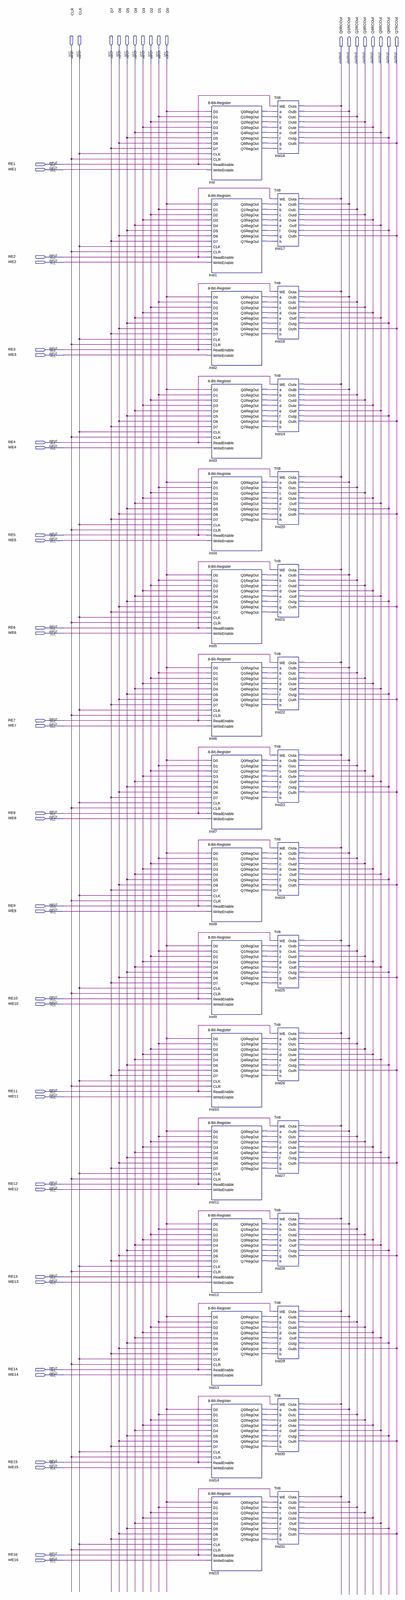
[diagram p0: schematic sheet, whole]
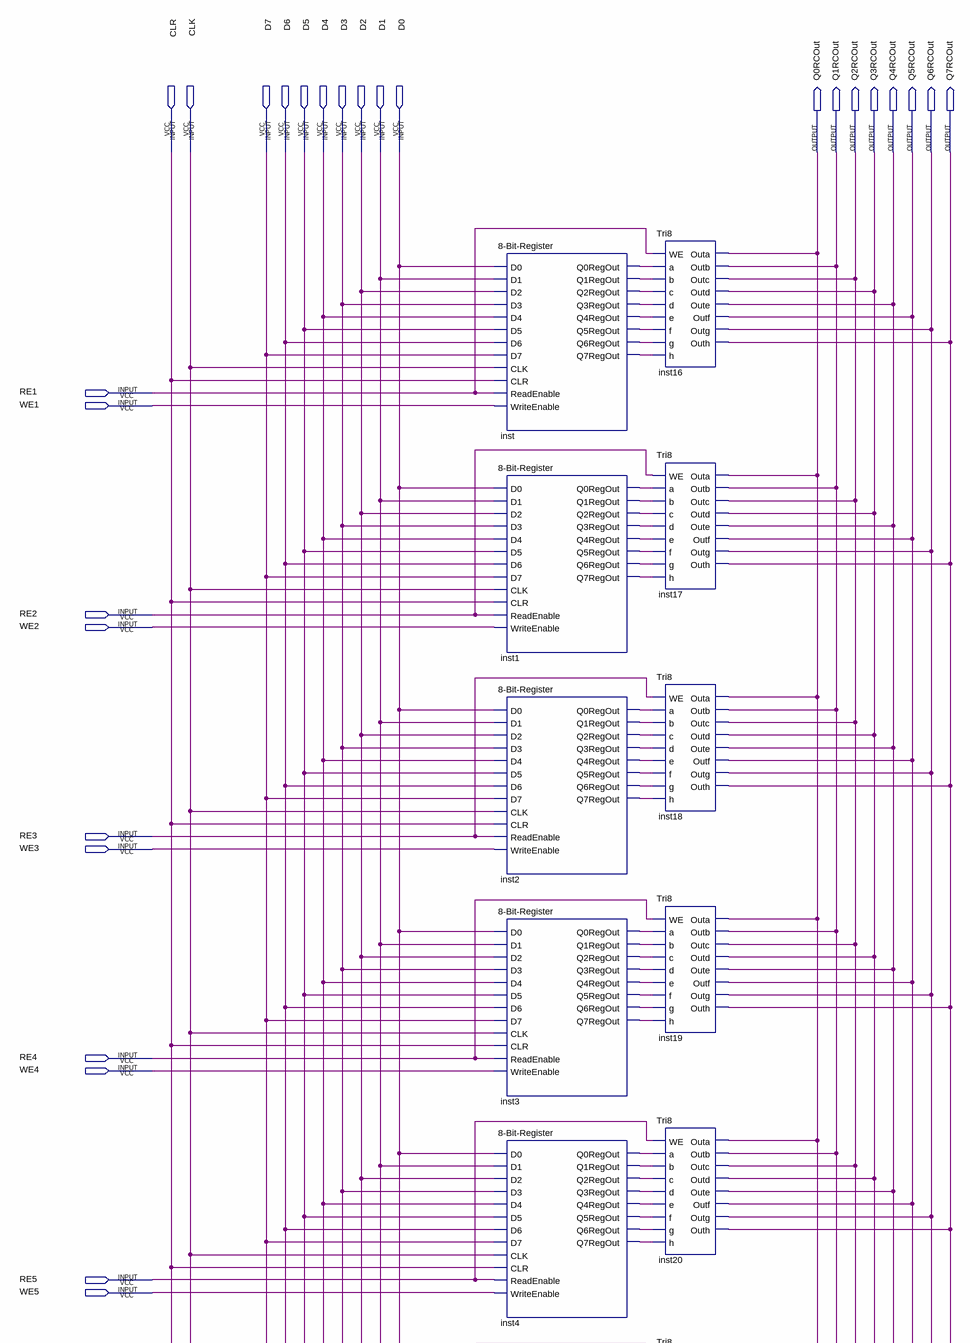
[diagram p1: schematic sheet, upper part]
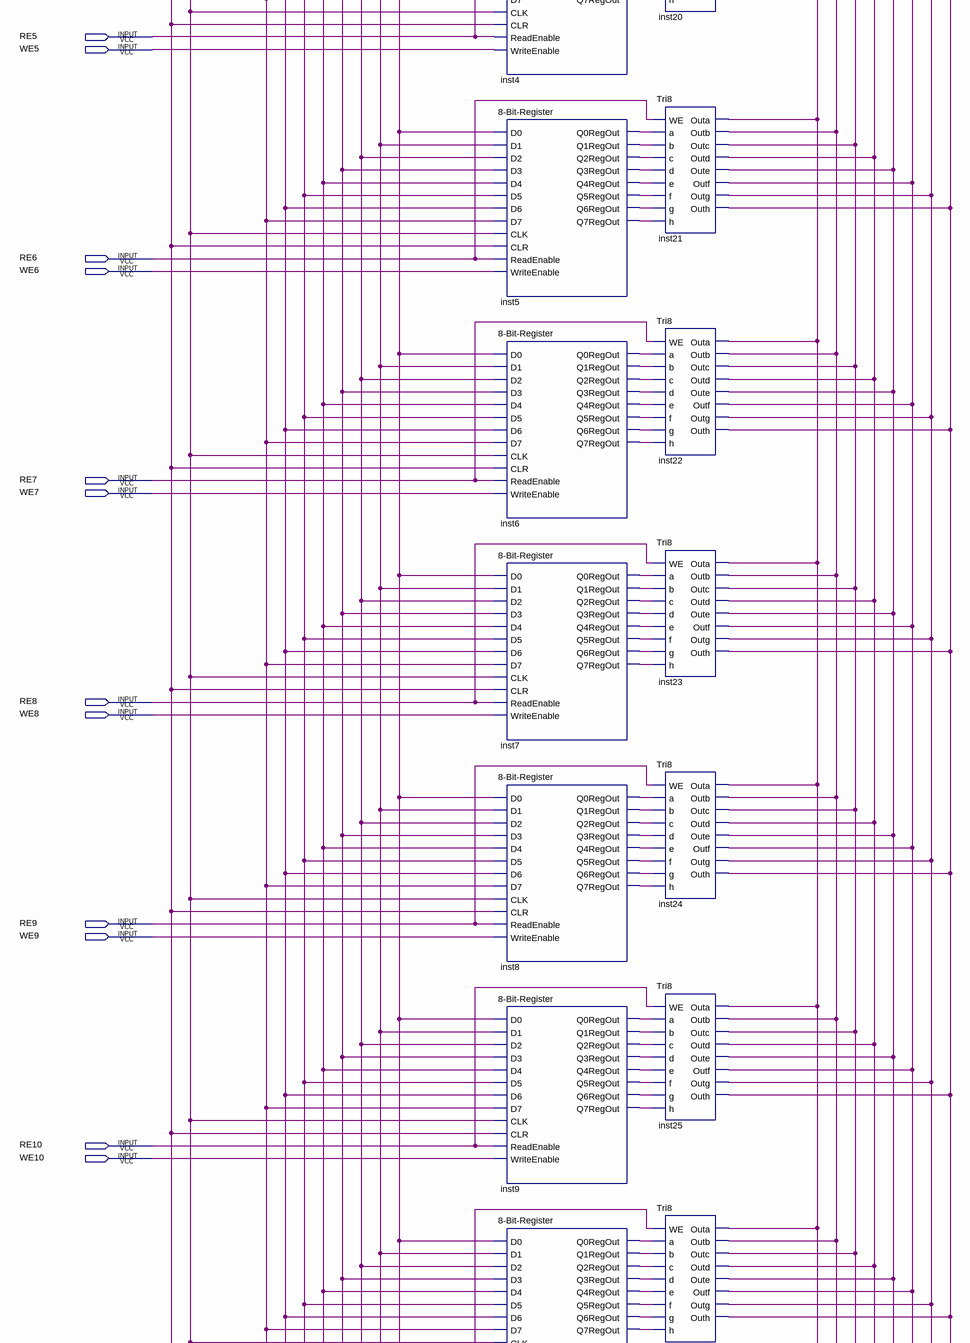
[diagram p2: schematic sheet, middle part]
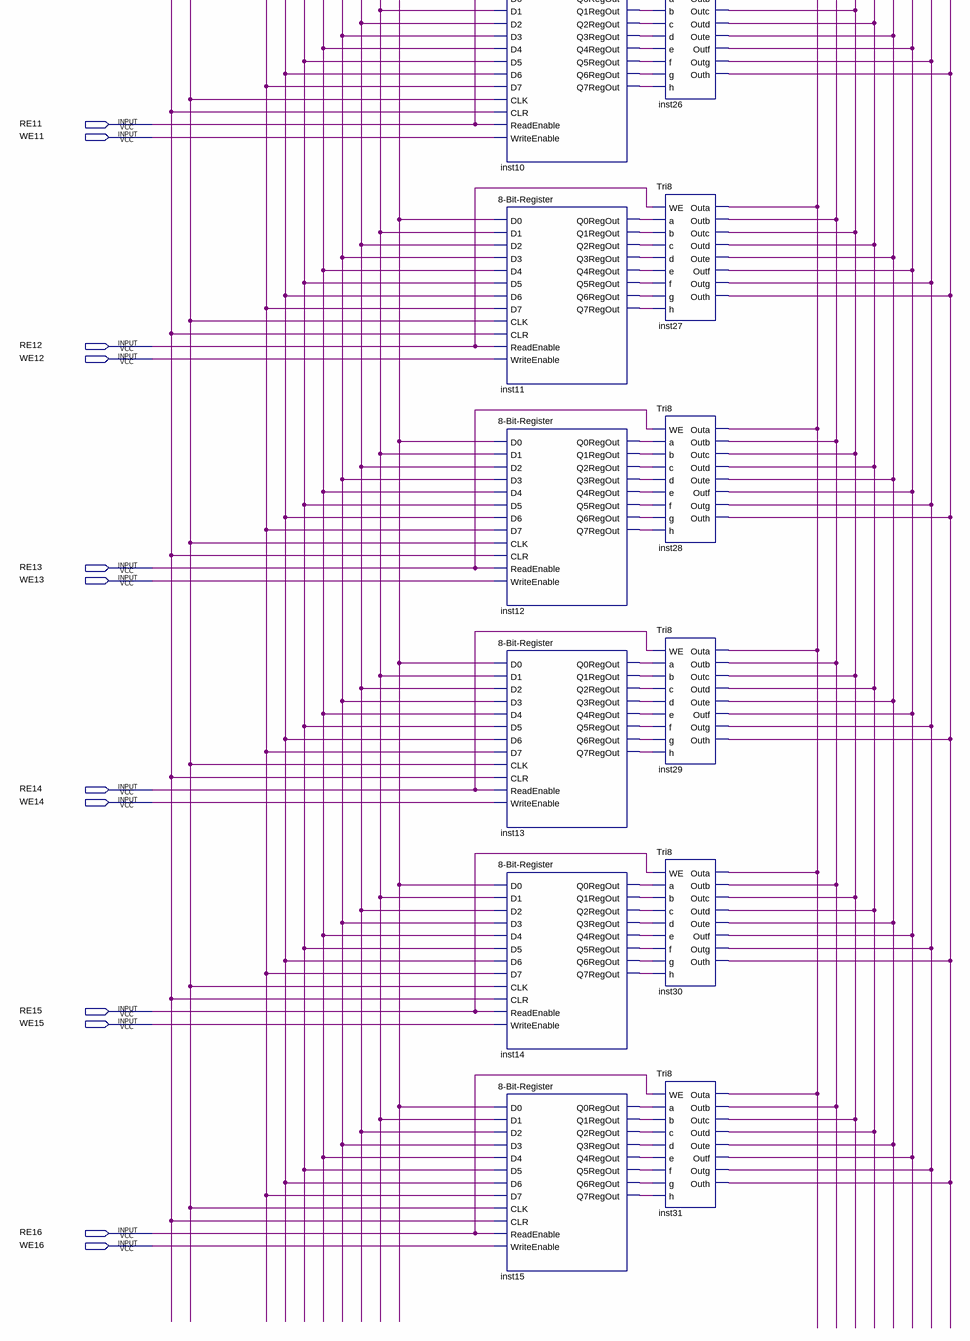
[diagram p3: schematic sheet, lower part]
// Quartus schematic RamCell-16B.bdf as structural Verilog: 32 symbols, 50 pins
module \RamCell-16B  (
  input  CLR,
  input  CLK,
  input  D7,
  input  D6,
  input  D5,
  input  D4,
  input  D3,
  input  D2,
  input  D1,
  input  D0,
  input  RE1,
  input  WE1,
  input  RE2,
  input  WE2,
  input  RE3,
  input  WE3,
  input  RE4,
  input  WE4,
  input  RE5,
  input  WE5,
  input  RE6,
  input  WE6,
  input  RE7,
  input  WE7,
  input  RE8,
  input  WE8,
  input  RE9,
  input  WE9,
  input  RE10,
  input  WE10,
  input  RE11,
  input  WE11,
  input  RE12,
  input  WE12,
  input  RE13,
  input  WE13,
  input  RE14,
  input  WE14,
  input  RE15,
  input  WE15,
  input  RE16,
  input  WE16,
  output Q0RCOut,
  output Q1RCOut,
  output Q2RCOut,
  output Q3RCOut,
  output Q4RCOut,
  output Q5RCOut,
  output Q6RCOut,
  output Q7RCOut
);

  wire inst1_q0regout, inst1_q1regout, inst1_q2regout, inst1_q3regout, inst1_q4regout, inst1_q5regout,
       inst1_q6regout, inst1_q7regout, inst2_q0regout, inst2_q1regout, inst2_q2regout, inst2_q3regout,
       inst2_q4regout, inst2_q5regout, inst2_q6regout, inst2_q7regout, inst3_q0regout, inst3_q1regout,
       inst3_q2regout, inst3_q3regout, inst3_q4regout, inst3_q5regout, inst3_q6regout, inst3_q7regout,
       inst4_q0regout, inst4_q1regout, inst4_q2regout, inst4_q3regout, inst4_q4regout, inst4_q5regout,
       inst4_q6regout, inst4_q7regout, inst5_q0regout, inst5_q1regout, inst5_q2regout, inst5_q3regout,
       inst5_q4regout, inst5_q5regout, inst5_q6regout, inst5_q7regout, inst6_q0regout, inst6_q1regout,
       inst6_q2regout, inst6_q3regout, inst6_q4regout, inst6_q5regout, inst6_q6regout, inst6_q7regout,
       inst7_q0regout, inst7_q1regout, inst7_q2regout, inst7_q3regout, inst7_q4regout, inst7_q5regout,
       inst7_q6regout, inst7_q7regout, inst8_q0regout, inst8_q1regout, inst8_q2regout, inst8_q3regout,
       inst8_q4regout, inst8_q5regout, inst8_q6regout, inst8_q7regout, inst9_q0regout, inst9_q1regout,
       inst9_q2regout, inst9_q3regout, inst9_q4regout, inst9_q5regout, inst9_q6regout, inst9_q7regout,
       inst10_q0regout, inst10_q1regout, inst10_q2regout, inst10_q3regout, inst10_q4regout, inst10_q5regout,
       inst10_q6regout, inst10_q7regout, inst11_q0regout, inst11_q1regout, inst11_q2regout, inst11_q3regout,
       inst11_q4regout, inst11_q5regout, inst11_q6regout, inst11_q7regout, inst12_q0regout, inst12_q1regout,
       inst12_q2regout, inst12_q3regout, inst12_q4regout, inst12_q5regout, inst12_q6regout, inst12_q7regout,
       inst13_q0regout, inst13_q1regout, inst13_q2regout, inst13_q3regout, inst13_q4regout, inst13_q5regout,
       inst13_q6regout, inst13_q7regout, inst14_q0regout, inst14_q1regout, inst14_q2regout, inst14_q3regout,
       inst14_q4regout, inst14_q5regout, inst14_q6regout, inst14_q7regout, inst15_q0regout, inst15_q1regout,
       inst15_q2regout, inst15_q3regout, inst15_q4regout, inst15_q5regout, inst15_q6regout, inst15_q7regout,
       inst_q0regout, inst_q1regout, inst_q2regout, inst_q3regout, inst_q4regout, inst_q5regout,
       inst_q6regout, inst_q7regout;

  \8-Bit-Register  inst (
    .D0(D0), .D1(D1), .D2(D2), .D3(D3), .D4(D4), .D5(D5), .D6(D6), .D7(D7), .CLK(CLK), .CLR(CLR),
    .ReadEnable(RE1), .WriteEnable(WE1), .Q0RegOut(inst_q0regout), .Q1RegOut(inst_q1regout),
    .Q2RegOut(inst_q2regout), .Q3RegOut(inst_q3regout), .Q4RegOut(inst_q4regout), .Q5RegOut(inst_q5regout),
    .Q6RegOut(inst_q6regout), .Q7RegOut(inst_q7regout));
  \8-Bit-Register  inst1 (
    .D0(D0), .D1(D1), .D2(D2), .D3(D3), .D4(D4), .D5(D5), .D6(D6), .D7(D7), .CLK(CLK), .CLR(CLR),
    .ReadEnable(RE2), .WriteEnable(WE2), .Q0RegOut(inst1_q0regout), .Q1RegOut(inst1_q1regout),
    .Q2RegOut(inst1_q2regout), .Q3RegOut(inst1_q3regout), .Q4RegOut(inst1_q4regout),
    .Q5RegOut(inst1_q5regout), .Q6RegOut(inst1_q6regout), .Q7RegOut(inst1_q7regout));
  \8-Bit-Register  inst2 (
    .D0(D0), .D1(D1), .D2(D2), .D3(D3), .D4(D4), .D5(D5), .D6(D6), .D7(D7), .CLK(CLK), .CLR(CLR),
    .ReadEnable(RE3), .WriteEnable(WE3), .Q0RegOut(inst2_q0regout), .Q1RegOut(inst2_q1regout),
    .Q2RegOut(inst2_q2regout), .Q3RegOut(inst2_q3regout), .Q4RegOut(inst2_q4regout),
    .Q5RegOut(inst2_q5regout), .Q6RegOut(inst2_q6regout), .Q7RegOut(inst2_q7regout));
  \8-Bit-Register  inst3 (
    .D0(D0), .D1(D1), .D2(D2), .D3(D3), .D4(D4), .D5(D5), .D6(D6), .D7(D7), .CLK(CLK), .CLR(CLR),
    .ReadEnable(RE4), .WriteEnable(WE4), .Q0RegOut(inst3_q0regout), .Q1RegOut(inst3_q1regout),
    .Q2RegOut(inst3_q2regout), .Q3RegOut(inst3_q3regout), .Q4RegOut(inst3_q4regout),
    .Q5RegOut(inst3_q5regout), .Q6RegOut(inst3_q6regout), .Q7RegOut(inst3_q7regout));
  \8-Bit-Register  inst4 (
    .D0(D0), .D1(D1), .D2(D2), .D3(D3), .D4(D4), .D5(D5), .D6(D6), .D7(D7), .CLK(CLK), .CLR(CLR),
    .ReadEnable(RE5), .WriteEnable(WE5), .Q0RegOut(inst4_q0regout), .Q1RegOut(inst4_q1regout),
    .Q2RegOut(inst4_q2regout), .Q3RegOut(inst4_q3regout), .Q4RegOut(inst4_q4regout),
    .Q5RegOut(inst4_q5regout), .Q6RegOut(inst4_q6regout), .Q7RegOut(inst4_q7regout));
  \8-Bit-Register  inst5 (
    .D0(D0), .D1(D1), .D2(D2), .D3(D3), .D4(D4), .D5(D5), .D6(D6), .D7(D7), .CLK(CLK), .CLR(CLR),
    .ReadEnable(RE6), .WriteEnable(WE6), .Q0RegOut(inst5_q0regout), .Q1RegOut(inst5_q1regout),
    .Q2RegOut(inst5_q2regout), .Q3RegOut(inst5_q3regout), .Q4RegOut(inst5_q4regout),
    .Q5RegOut(inst5_q5regout), .Q6RegOut(inst5_q6regout), .Q7RegOut(inst5_q7regout));
  \8-Bit-Register  inst6 (
    .D0(D0), .D1(D1), .D2(D2), .D3(D3), .D4(D4), .D5(D5), .D6(D6), .D7(D7), .CLK(CLK), .CLR(CLR),
    .ReadEnable(RE7), .WriteEnable(WE7), .Q0RegOut(inst6_q0regout), .Q1RegOut(inst6_q1regout),
    .Q2RegOut(inst6_q2regout), .Q3RegOut(inst6_q3regout), .Q4RegOut(inst6_q4regout),
    .Q5RegOut(inst6_q5regout), .Q6RegOut(inst6_q6regout), .Q7RegOut(inst6_q7regout));
  \8-Bit-Register  inst7 (
    .D0(D0), .D1(D1), .D2(D2), .D3(D3), .D4(D4), .D5(D5), .D6(D6), .D7(D7), .CLK(CLK), .CLR(CLR),
    .ReadEnable(RE8), .WriteEnable(WE8), .Q0RegOut(inst7_q0regout), .Q1RegOut(inst7_q1regout),
    .Q2RegOut(inst7_q2regout), .Q3RegOut(inst7_q3regout), .Q4RegOut(inst7_q4regout),
    .Q5RegOut(inst7_q5regout), .Q6RegOut(inst7_q6regout), .Q7RegOut(inst7_q7regout));
  \8-Bit-Register  inst8 (
    .D0(D0), .D1(D1), .D2(D2), .D3(D3), .D4(D4), .D5(D5), .D6(D6), .D7(D7), .CLK(CLK), .CLR(CLR),
    .ReadEnable(RE9), .WriteEnable(WE9), .Q0RegOut(inst8_q0regout), .Q1RegOut(inst8_q1regout),
    .Q2RegOut(inst8_q2regout), .Q3RegOut(inst8_q3regout), .Q4RegOut(inst8_q4regout),
    .Q5RegOut(inst8_q5regout), .Q6RegOut(inst8_q6regout), .Q7RegOut(inst8_q7regout));
  \8-Bit-Register  inst9 (
    .D0(D0), .D1(D1), .D2(D2), .D3(D3), .D4(D4), .D5(D5), .D6(D6), .D7(D7), .CLK(CLK), .CLR(CLR),
    .ReadEnable(RE10), .WriteEnable(WE10), .Q0RegOut(inst9_q0regout), .Q1RegOut(inst9_q1regout),
    .Q2RegOut(inst9_q2regout), .Q3RegOut(inst9_q3regout), .Q4RegOut(inst9_q4regout),
    .Q5RegOut(inst9_q5regout), .Q6RegOut(inst9_q6regout), .Q7RegOut(inst9_q7regout));
  \8-Bit-Register  inst10 (
    .D0(D0), .D1(D1), .D2(D2), .D3(D3), .D4(D4), .D5(D5), .D6(D6), .D7(D7), .CLK(CLK), .CLR(CLR),
    .ReadEnable(RE11), .WriteEnable(WE11), .Q0RegOut(inst10_q0regout), .Q1RegOut(inst10_q1regout),
    .Q2RegOut(inst10_q2regout), .Q3RegOut(inst10_q3regout), .Q4RegOut(inst10_q4regout),
    .Q5RegOut(inst10_q5regout), .Q6RegOut(inst10_q6regout), .Q7RegOut(inst10_q7regout));
  \8-Bit-Register  inst11 (
    .D0(D0), .D1(D1), .D2(D2), .D3(D3), .D4(D4), .D5(D5), .D6(D6), .D7(D7), .CLK(CLK), .CLR(CLR),
    .ReadEnable(RE12), .WriteEnable(WE12), .Q0RegOut(inst11_q0regout), .Q1RegOut(inst11_q1regout),
    .Q2RegOut(inst11_q2regout), .Q3RegOut(inst11_q3regout), .Q4RegOut(inst11_q4regout),
    .Q5RegOut(inst11_q5regout), .Q6RegOut(inst11_q6regout), .Q7RegOut(inst11_q7regout));
  \8-Bit-Register  inst12 (
    .D0(D0), .D1(D1), .D2(D2), .D3(D3), .D4(D4), .D5(D5), .D6(D6), .D7(D7), .CLK(CLK), .CLR(CLR),
    .ReadEnable(RE13), .WriteEnable(WE13), .Q0RegOut(inst12_q0regout), .Q1RegOut(inst12_q1regout),
    .Q2RegOut(inst12_q2regout), .Q3RegOut(inst12_q3regout), .Q4RegOut(inst12_q4regout),
    .Q5RegOut(inst12_q5regout), .Q6RegOut(inst12_q6regout), .Q7RegOut(inst12_q7regout));
  \8-Bit-Register  inst13 (
    .D0(D0), .D1(D1), .D2(D2), .D3(D3), .D4(D4), .D5(D5), .D6(D6), .D7(D7), .CLK(CLK), .CLR(CLR),
    .ReadEnable(RE14), .WriteEnable(WE14), .Q0RegOut(inst13_q0regout), .Q1RegOut(inst13_q1regout),
    .Q2RegOut(inst13_q2regout), .Q3RegOut(inst13_q3regout), .Q4RegOut(inst13_q4regout),
    .Q5RegOut(inst13_q5regout), .Q6RegOut(inst13_q6regout), .Q7RegOut(inst13_q7regout));
  \8-Bit-Register  inst14 (
    .D0(D0), .D1(D1), .D2(D2), .D3(D3), .D4(D4), .D5(D5), .D6(D6), .D7(D7), .CLK(CLK), .CLR(CLR),
    .ReadEnable(RE15), .WriteEnable(WE15), .Q0RegOut(inst14_q0regout), .Q1RegOut(inst14_q1regout),
    .Q2RegOut(inst14_q2regout), .Q3RegOut(inst14_q3regout), .Q4RegOut(inst14_q4regout),
    .Q5RegOut(inst14_q5regout), .Q6RegOut(inst14_q6regout), .Q7RegOut(inst14_q7regout));
  \8-Bit-Register  inst15 (
    .D0(D0), .D1(D1), .D2(D2), .D3(D3), .D4(D4), .D5(D5), .D6(D6), .D7(D7), .CLK(CLK), .CLR(CLR),
    .ReadEnable(RE16), .WriteEnable(WE16), .Q0RegOut(inst15_q0regout), .Q1RegOut(inst15_q1regout),
    .Q2RegOut(inst15_q2regout), .Q3RegOut(inst15_q3regout), .Q4RegOut(inst15_q4regout),
    .Q5RegOut(inst15_q5regout), .Q6RegOut(inst15_q6regout), .Q7RegOut(inst15_q7regout));
  Tri8 inst16 (
    .WE(RE1), .a(inst_q0regout), .b(inst_q1regout), .c(inst_q2regout), .d(inst_q3regout), .e(inst_q4regout),
    .f(inst_q5regout), .g(inst_q6regout), .h(inst_q7regout), .Outa(Q0RCOut), .Outb(Q1RCOut), .Outc(Q2RCOut),
    .Outd(Q3RCOut), .Oute(Q4RCOut), .Outf(Q5RCOut), .Outg(Q6RCOut), .Outh(Q7RCOut));
  Tri8 inst17 (
    .WE(RE2), .a(inst1_q0regout), .b(inst1_q1regout), .c(inst1_q2regout), .d(inst1_q3regout),
    .e(inst1_q4regout), .f(inst1_q5regout), .g(inst1_q6regout), .h(inst1_q7regout), .Outa(Q0RCOut),
    .Outb(Q1RCOut), .Outc(Q2RCOut), .Outd(Q3RCOut), .Oute(Q4RCOut), .Outf(Q5RCOut), .Outg(Q6RCOut),
    .Outh(Q7RCOut));
  Tri8 inst18 (
    .WE(RE3), .a(inst2_q0regout), .b(inst2_q1regout), .c(inst2_q2regout), .d(inst2_q3regout),
    .e(inst2_q4regout), .f(inst2_q5regout), .g(inst2_q6regout), .h(inst2_q7regout), .Outa(Q0RCOut),
    .Outb(Q1RCOut), .Outc(Q2RCOut), .Outd(Q3RCOut), .Oute(Q4RCOut), .Outf(Q5RCOut), .Outg(Q6RCOut),
    .Outh(Q7RCOut));
  Tri8 inst19 (
    .WE(RE4), .a(inst3_q0regout), .b(inst3_q1regout), .c(inst3_q2regout), .d(inst3_q3regout),
    .e(inst3_q4regout), .f(inst3_q5regout), .g(inst3_q6regout), .h(inst3_q7regout), .Outa(Q0RCOut),
    .Outb(Q1RCOut), .Outc(Q2RCOut), .Outd(Q3RCOut), .Oute(Q4RCOut), .Outf(Q5RCOut), .Outg(Q6RCOut),
    .Outh(Q7RCOut));
  Tri8 inst20 (
    .WE(RE5), .a(inst4_q0regout), .b(inst4_q1regout), .c(inst4_q2regout), .d(inst4_q3regout),
    .e(inst4_q4regout), .f(inst4_q5regout), .g(inst4_q6regout), .h(inst4_q7regout), .Outa(Q0RCOut),
    .Outb(Q1RCOut), .Outc(Q2RCOut), .Outd(Q3RCOut), .Oute(Q4RCOut), .Outf(Q5RCOut), .Outg(Q6RCOut),
    .Outh(Q7RCOut));
  Tri8 inst21 (
    .WE(RE6), .a(inst5_q0regout), .b(inst5_q1regout), .c(inst5_q2regout), .d(inst5_q3regout),
    .e(inst5_q4regout), .f(inst5_q5regout), .g(inst5_q6regout), .h(inst5_q7regout), .Outa(Q0RCOut),
    .Outb(Q1RCOut), .Outc(Q2RCOut), .Outd(Q3RCOut), .Oute(Q4RCOut), .Outf(Q5RCOut), .Outg(Q6RCOut),
    .Outh(Q7RCOut));
  Tri8 inst22 (
    .WE(RE7), .a(inst6_q0regout), .b(inst6_q1regout), .c(inst6_q2regout), .d(inst6_q3regout),
    .e(inst6_q4regout), .f(inst6_q5regout), .g(inst6_q6regout), .h(inst6_q7regout), .Outa(Q0RCOut),
    .Outb(Q1RCOut), .Outc(Q2RCOut), .Outd(Q3RCOut), .Oute(Q4RCOut), .Outf(Q5RCOut), .Outg(Q6RCOut),
    .Outh(Q7RCOut));
  Tri8 inst23 (
    .WE(RE8), .a(inst7_q0regout), .b(inst7_q1regout), .c(inst7_q2regout), .d(inst7_q3regout),
    .e(inst7_q4regout), .f(inst7_q5regout), .g(inst7_q6regout), .h(inst7_q7regout), .Outa(Q0RCOut),
    .Outb(Q1RCOut), .Outc(Q2RCOut), .Outd(Q3RCOut), .Oute(Q4RCOut), .Outf(Q5RCOut), .Outg(Q6RCOut),
    .Outh(Q7RCOut));
  Tri8 inst24 (
    .WE(RE9), .a(inst8_q0regout), .b(inst8_q1regout), .c(inst8_q2regout), .d(inst8_q3regout),
    .e(inst8_q4regout), .f(inst8_q5regout), .g(inst8_q6regout), .h(inst8_q7regout), .Outa(Q0RCOut),
    .Outb(Q1RCOut), .Outc(Q2RCOut), .Outd(Q3RCOut), .Oute(Q4RCOut), .Outf(Q5RCOut), .Outg(Q6RCOut),
    .Outh(Q7RCOut));
  Tri8 inst25 (
    .WE(RE10), .a(inst9_q0regout), .b(inst9_q1regout), .c(inst9_q2regout), .d(inst9_q3regout),
    .e(inst9_q4regout), .f(inst9_q5regout), .g(inst9_q6regout), .h(inst9_q7regout), .Outa(Q0RCOut),
    .Outb(Q1RCOut), .Outc(Q2RCOut), .Outd(Q3RCOut), .Oute(Q4RCOut), .Outf(Q5RCOut), .Outg(Q6RCOut),
    .Outh(Q7RCOut));
  Tri8 inst26 (
    .WE(RE11), .a(inst10_q0regout), .b(inst10_q1regout), .c(inst10_q2regout), .d(inst10_q3regout),
    .e(inst10_q4regout), .f(inst10_q5regout), .g(inst10_q6regout), .h(inst10_q7regout), .Outa(Q0RCOut),
    .Outb(Q1RCOut), .Outc(Q2RCOut), .Outd(Q3RCOut), .Oute(Q4RCOut), .Outf(Q5RCOut), .Outg(Q6RCOut),
    .Outh(Q7RCOut));
  Tri8 inst27 (
    .WE(RE12), .a(inst11_q0regout), .b(inst11_q1regout), .c(inst11_q2regout), .d(inst11_q3regout),
    .e(inst11_q4regout), .f(inst11_q5regout), .g(inst11_q6regout), .h(inst11_q7regout), .Outa(Q0RCOut),
    .Outb(Q1RCOut), .Outc(Q2RCOut), .Outd(Q3RCOut), .Oute(Q4RCOut), .Outf(Q5RCOut), .Outg(Q6RCOut),
    .Outh(Q7RCOut));
  Tri8 inst28 (
    .WE(RE13), .a(inst12_q0regout), .b(inst12_q1regout), .c(inst12_q2regout), .d(inst12_q3regout),
    .e(inst12_q4regout), .f(inst12_q5regout), .g(inst12_q6regout), .h(inst12_q7regout), .Outa(Q0RCOut),
    .Outb(Q1RCOut), .Outc(Q2RCOut), .Outd(Q3RCOut), .Oute(Q4RCOut), .Outf(Q5RCOut), .Outg(Q6RCOut),
    .Outh(Q7RCOut));
  Tri8 inst29 (
    .WE(RE14), .a(inst13_q0regout), .b(inst13_q1regout), .c(inst13_q2regout), .d(inst13_q3regout),
    .e(inst13_q4regout), .f(inst13_q5regout), .g(inst13_q6regout), .h(inst13_q7regout), .Outa(Q0RCOut),
    .Outb(Q1RCOut), .Outc(Q2RCOut), .Outd(Q3RCOut), .Oute(Q4RCOut), .Outf(Q5RCOut), .Outg(Q6RCOut),
    .Outh(Q7RCOut));
  Tri8 inst30 (
    .WE(RE15), .a(inst14_q0regout), .b(inst14_q1regout), .c(inst14_q2regout), .d(inst14_q3regout),
    .e(inst14_q4regout), .f(inst14_q5regout), .g(inst14_q6regout), .h(inst14_q7regout), .Outa(Q0RCOut),
    .Outb(Q1RCOut), .Outc(Q2RCOut), .Outd(Q3RCOut), .Oute(Q4RCOut), .Outf(Q5RCOut), .Outg(Q6RCOut),
    .Outh(Q7RCOut));
  Tri8 inst31 (
    .WE(RE16), .a(inst15_q0regout), .b(inst15_q1regout), .c(inst15_q2regout), .d(inst15_q3regout),
    .e(inst15_q4regout), .f(inst15_q5regout), .g(inst15_q6regout), .h(inst15_q7regout), .Outa(Q0RCOut),
    .Outb(Q1RCOut), .Outc(Q2RCOut), .Outd(Q3RCOut), .Oute(Q4RCOut), .Outf(Q5RCOut), .Outg(Q6RCOut),
    .Outh(Q7RCOut));
endmodule
